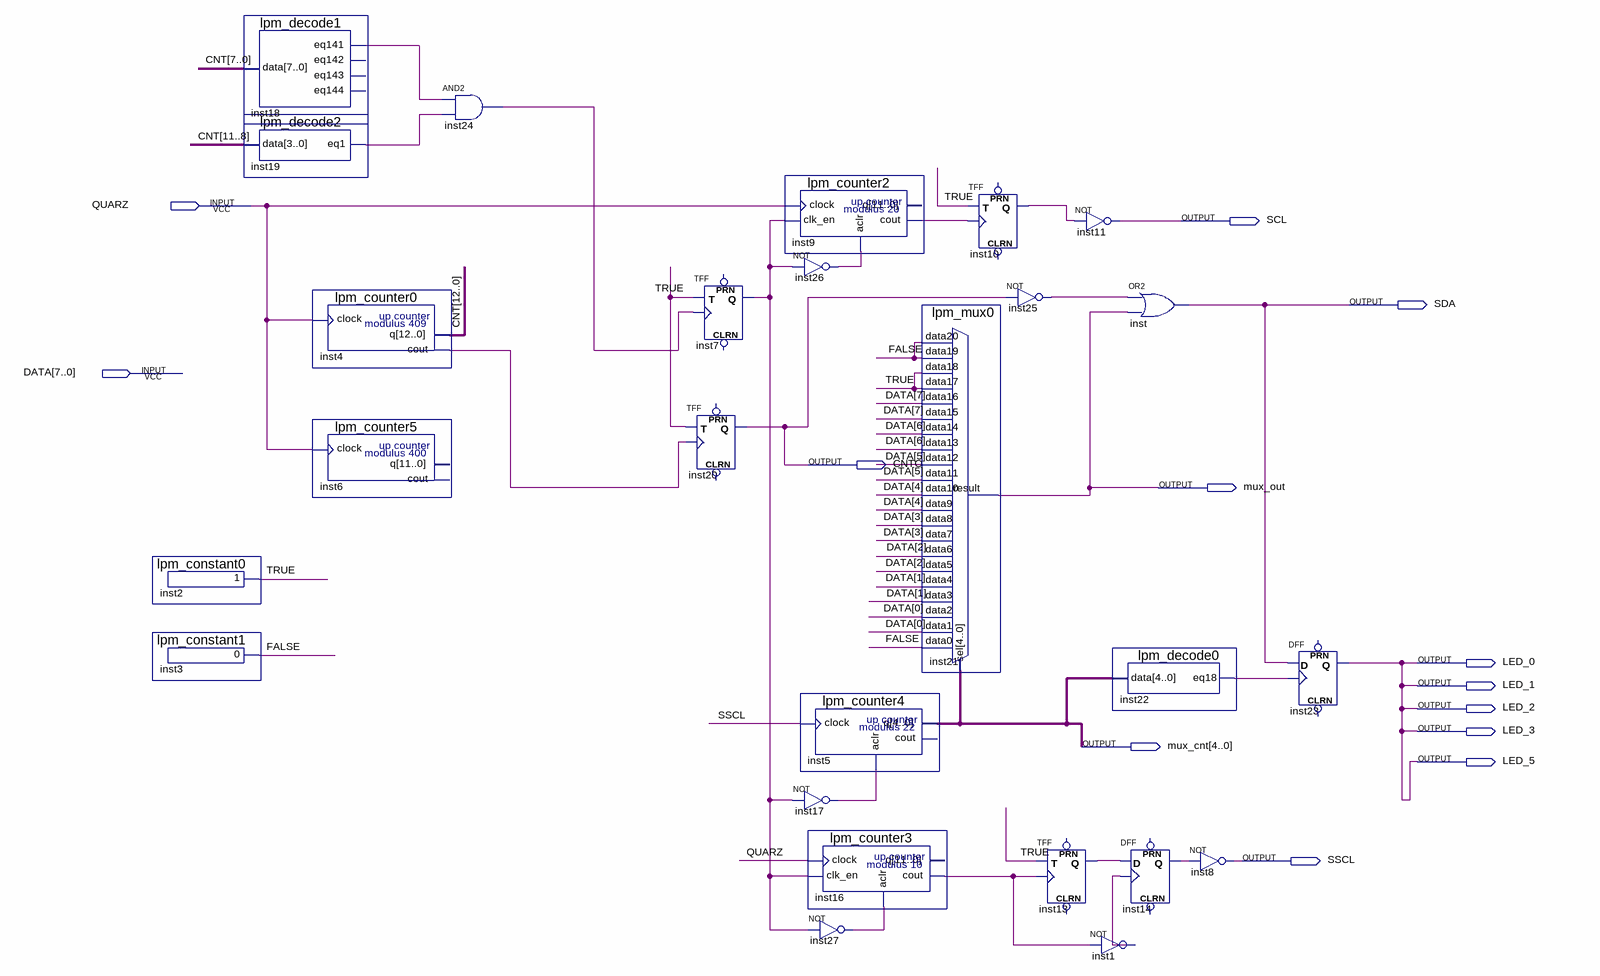
[diagram p0: schematic sheet]
// Quartus schematic i2c.bdf as structural Verilog: 26 symbols, 13 pins
module i2c (
  input  QUARZ,
  input  [7:0] DATA,
  output SCL,
  output SDA,
  output CNTO,
  output mux_out,
  output LED_0,
  output LED_1,
  output LED_2,
  output LED_3,
  output [4:0] mux_cnt,
  output LED_5,
  output SSCL
);

  wire FALSE, inst1_out, inst4_cout, inst7_q, inst9_cout, inst10_q, inst13_q, inst14_q, inst16_cout,
       inst17_out, inst18_eq141, inst19_eq1, inst22_eq18, inst24_out, inst25_out, inst26_out, inst27_out,
       TRUE;
  wire [12:0] CNT;

  lpm_constant0 inst2 (.result(TRUE));
  lpm_constant1 inst3 (.result(FALSE));
  lpm_decode1 inst18 (.data(CNT[7:0]), .eq141(inst18_eq141));  // open: eq142, eq143, eq144
  lpm_decode2 inst19 (.data(CNT[11:8]), .eq1(inst19_eq1));
  lpm_counter0 inst4 (.clock(QUARZ), .cout(inst4_cout), .q(CNT));
  lpm_counter5 inst6 (.clock(QUARZ));  // open: cout, q
  and inst24 (inst24_out, inst18_eq141, inst19_eq1);
  TFF inst7 (.T(TRUE), .CLK(inst24_out), .Q(inst7_q));  // open: PRN, CLRN
  TFF inst20 (.T(TRUE), .CLK(inst4_cout), .Q(CNTO));  // open: PRN, CLRN
  lpm_counter2 inst9 (.clock(QUARZ), .clk_en(inst7_q), .aclr(inst26_out), .cout(inst9_cout));  // open: q
  not inst26 (inst26_out, inst7_q);
  not inst17 (inst17_out, inst7_q);
  lpm_counter4 inst5 (.clock(SSCL), .aclr(inst17_out), .q(mux_cnt));  // open: cout
  lpm_counter3 inst16 (.clock(QUARZ), .clk_en(inst7_q), .aclr(inst27_out), .cout(inst16_cout));  // open: q
  not inst27 (inst27_out, inst7_q);
  TFF inst10 (.T(TRUE), .CLK(inst9_cout), .Q(inst10_q));  // open: PRN, CLRN
  lpm_mux0 inst21 (
    .data20(FALSE), .data19(FALSE), .data18(TRUE), .data17(TRUE), .data16(DATA[7]), .data15(DATA[7]),
    .data14(DATA[6]), .data13(DATA[6]), .data12(DATA[5]), .data11(DATA[5]), .data10(DATA[4]),
    .data9(DATA[4]), .data8(DATA[3]), .data7(DATA[3]), .data6(DATA[2]), .data5(DATA[2]), .data4(DATA[1]),
    .data3(DATA[1]), .data2(DATA[0]), .data1(DATA[0]), .data0(FALSE), .sel(mux_cnt), .result(mux_out));
  not inst25 (inst25_out, CNTO);
  TFF inst13 (.T(TRUE), .CLK(inst16_cout), .Q(inst13_q));  // open: PRN, CLRN
  not inst11 (SCL, inst10_q);
  not inst1 (inst1_out, inst16_cout);
  or inst (SDA, inst25_out, mux_out);
  lpm_decode0 inst22 (.data(mux_cnt), .eq18(inst22_eq18));
  DFF inst14 (.CLK(inst1_out), .D(inst13_q), .Q(inst14_q));  // open: CLRN, PRN
  not inst8 (SSCL, inst14_q);
  DFF inst23 (.CLK(inst22_eq18), .D(SDA), .Q(LED_0));  // open: CLRN, PRN

  assign LED_1 = LED_0;
  assign LED_2 = LED_0;
  assign LED_3 = LED_0;
  assign LED_5 = LED_0;
endmodule
